# EAGLE design plug-v19-Make-board-myself-to-test-circuit (EAGLE 7.6.0)
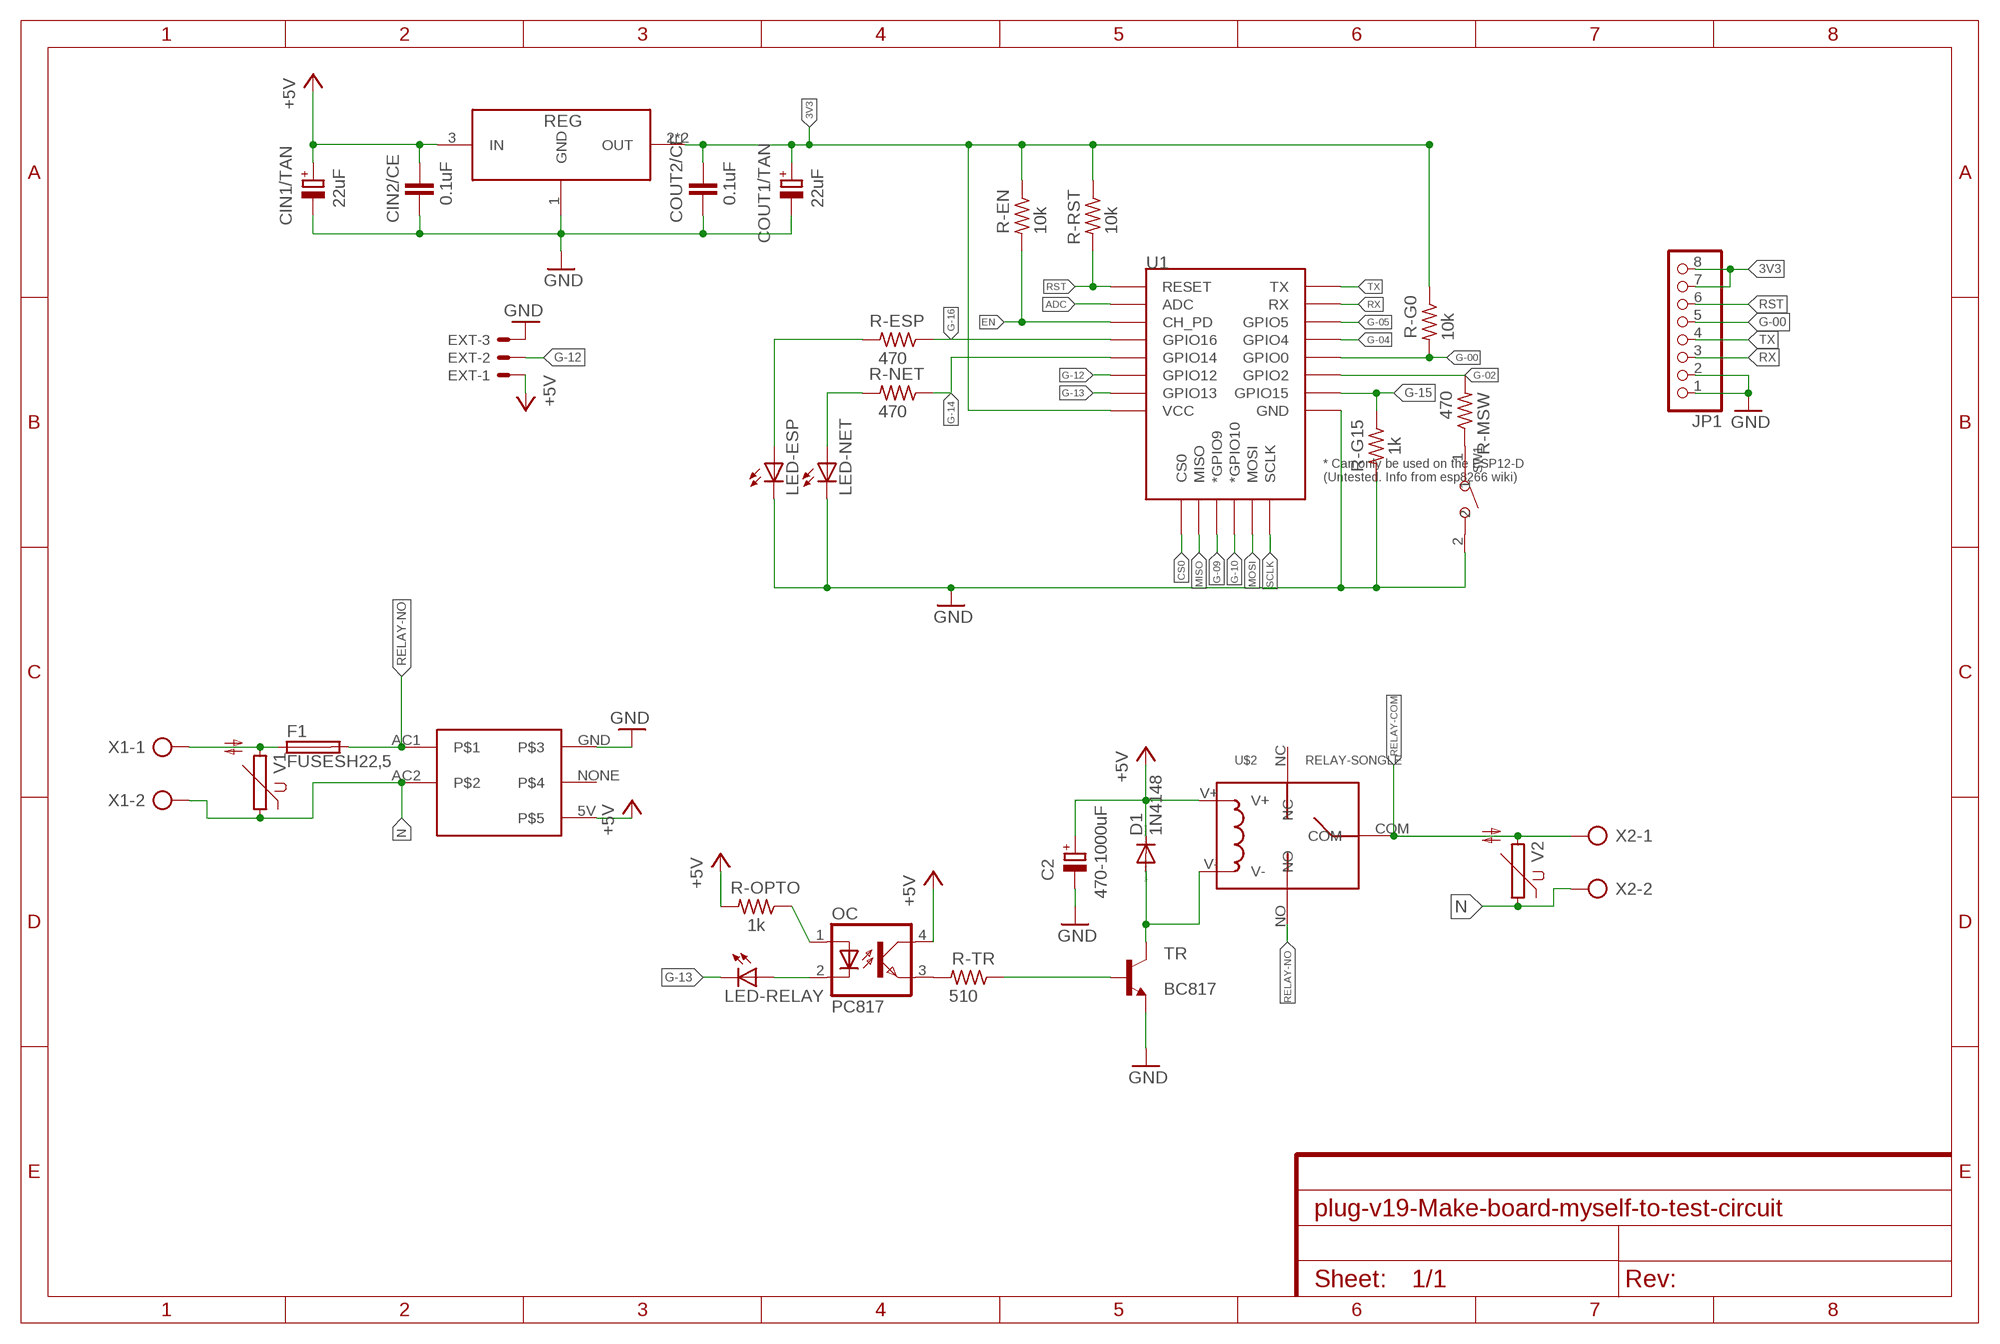
[diagram p0: schematic, sheet 1]

## Parts
C2  470-1000uF  CPOL-EUE3.5-8  [E3,5-8]
CIN1/TAN  22uF  CPOL-EUB/3528-21R  [B/3528-21R]
CIN2/CE  0.1uF  C-EUC0805K  [C0805K]
COUT1/TAN  22uF  CPOL-EUB/3528-21R  [B/3528-21R]
COUT2/CE  0.1uF  C-EUC0805K  [C0805K]
D1  1N4148  1N4148DO35-7  [DO35-7]
EXT  53048-03  [53048-03]
F1  FUSESH22,5  [SH22,5]
JP1  PINHD-1X8  [1X08]
LED-ESP  LEDCHIPLED_0805  [CHIPLED_0805]
LED-NET  LEDCHIPLED_0805  [CHIPLED_0805]
LED-RELAY  LEDCHIPLED_0805  [CHIPLED_0805]
OC  PC817  [DIL04]
R-EN  10k  R-US_M0805  [M0805]
R-ESP  470  R-US_M0805  [M0805]
R-G0  10k  R-US_M0805  [M0805]
R-G15  1k  R-US_M0805  [M0805]
R-MSW  470  R-US_M0805  [M0805]
R-NET  470  R-US_M0805  [M0805]
R-OPTO  1k  R-US_M0805  [M0805]
R-RST  10k  R-US_M0805  [M0805]
R-TR  510  R-US_M0805  [M0805]
REG  AMS1117-3.3  [SOT-223]
SW1  DIP-BUTTON(2P-6.0X3.0X4.3MM)-TS-1101F  [SW2-5.0-6.0X3.0X4.3MM]
TR  BC817  BC817-16SMD  [SOT23-BEC]
U1  ESP12ESMD  [ESP12E-SMD]
U$2  RELAY-SONGLE  [RELAY-SONGLE]
U$4  POWERSUPPLY-5V-700MA  [POWERSUPPLY-5V-700MA]
V1  S14K11  [S14K11]
V2  S14K11  [S14K11]
X1  AK300/2  [AK300/2]
X2  AK300/2  [AK300/2]

## Nets
3V3: COUT1/TAN.+ COUT2/CE.1 JP1.7 JP1.8 R-EN.1 R-G0.1 R-RST.1 REG.2(OUT) REG.4(OUT) U1.VCC
+5V: C2.+ CIN1/TAN.+ CIN2/CE.1 D1.C EXT.1 OC.4(COL) R-OPTO.2 REG.3(IN) U$2.V+ U$4.5V
ADC: U1.ADC
CS0: U1.CS0
EN: R-EN.2 U1.CH_PD
G-00: JP1.5 R-G0.2 U1.GPIO0
G-02: R-MSW.2 U1.GPIO2
G-04: U1.GPIO4
G-05: U1.GPIO5
G-09: U1.GPIO9(*GPIO9)
G-10: U1.GPIO10(*GPIO10)
G-12: EXT.2 U1.GPIO12
G-13: LED-RELAY.C U1.GPIO13
G-14: R-NET.1 U1.GPIO14
G-15: R-G15.1 U1.GPIO15
G-16: R-ESP.1 U1.GPIO16
GND: C2.- CIN1/TAN.- CIN2/CE.2 COUT1/TAN.- COUT2/CE.2 EXT.3 JP1.1 JP1.2 LED-ESP.C LED-NET.C R-G15.2 REG.1(GND) SW1.2 TR.E U1.GND U$4.GND
LINE: F1.1 V1.2 X1.1
MISO: U1.MISO
MOSI: U1.MOSI
N: U$4.AC2 V1.1 V2.1 X1.2 X2.2
N$1: OC.3(EMIT) R-TR.2
N$2: R-TR.1 TR.B
N$6: LED-ESP.A R-ESP.2
N$13: OC.1(A) R-OPTO.1
N$16: LED-NET.A R-NET.2
N$17: D1.A TR.C U$2.V-
N$21: LED-RELAY.A OC.2(C)
N$22: R-MSW.1 SW1.1
RELAY-COM: U$2.COM V2.2 X2.1
RELAY-NO: F1.2 U$2.NO U$4.AC1
RST: JP1.6 R-RST.2 U1.RESET
RX: JP1.3 U1.RXD0(RX)
SCLK: U1.SCLK
TX: JP1.4 U1.TXD0(TX)
Unconnected: U$2.NC U$4.NONE

## Library data of the parts
C2 CIN1/TAN COUT1/TAN = rcl:CPOL-EU: POLARIZED CAPACITOR, European symbol
CIN2/CE COUT2/CE = rcl:C-EU: CAPACITOR, European symbol
D1 = diode:1N4148: DIODE high speed (Philips)
EXT = con-molex:53?-03: CONNECTOR wire to board 1.25 mm (.049 inch) pitch header; MF: WALDOM/MOLEX; MPN: 53048-0310; OC_FARNELL: 9732918; OC_NEWARK: 38C9908
F1 = fuse:FUSE: Fuse; OC_FARNELL: unknown; OC_NEWARK: unknown
JP1 = pinhead:PINHD-1X8: PIN HEADER
LED-ESP LED-NET LED-RELAY = led:LED: LED OSRAM: - CHIPLED LG R971, LG N971, LY N971, LG Q971, LY Q971, LO R971, LY R971 LH N974, LH R974 LS Q976, LO Q976, LY Q976 LO Q996 - Hyper CHIPLED LW Q18S LB Q993, LB Q99A, LB R99A - SideLED LS A670, LO A670, LY A670, LG A670, LP A670 LB A673, LV A673, LT A673, LW A673 LH A674 LY A675 LS A676, LA A676, LO A676, LY A676, LW A676 LS A679, LY A679, LG A679 - Hyper Micro SIDELED® LS Y876, LA Y876, LO Y876, LY Y876 LT Y87S - SmartLED LW L88C, LW L88S LB L89C, LB L89S, LG L890 LS L89K, LO L89K, LY L89K LS L896, LA L896, LO L896, LY L896 - TOPLED LS T670, LO T670, LY T670, LG T670, LP T670 LSG T670, LSP T670, LSY T670, LOP T670, LYG T670 LG T671, LOG T671, LSG T671 LB T673, LV T673, LT T673, LW T673 LH T674 LS T676, LA T676, LO T676, LY T676, LB T676, LH T676, LSB T676, LW T676 LB T67C, LV T67C, LT T67C, LS T67K, LO T67K, LY T67K, LW E67C LS E67B, LA E67B, LO E67B, LY E67B, LB E67C, LV E67C, LT E67C LW T67C LS T679, LY T679, LG T679 LS T770, LO T770, LY T770, LG T770, LP T770 LB T773, LV T773, LT T773, LW T773 LH T774 LS E675, LA E675, LY E675, LS T675 LS T776, LA T776, LO T776, LY T776, LB T776 LHGB T686 LT T68C, LB T68C - Hyper Mini TOPLED® LB M676 - Mini TOPLED Santana® LG M470 LS M47K, LO M47K, LY M47K Source: http://www.osram.convergy.de LUXEON: - LUMILED® LXK2-PW12-R00, LXK2-PW12-S00, LXK2-PW14-U00, LXK2-PW14-V00 LXK2-PM12-R00, LXK2-PM12-S00, LXK2-PM14-U00 LXK2-PE12-Q00, LXK2-PE12-R00, LXK2-PE12-S00, LXK2-PE14-T00, LXK2-PE14-U00 LXK2-PB12-K00, LXK2-PB12-L00, LXK2-PB12-M00, LXK2-PB14-N00, LXK2-PB14-P00, LXK2-PB14-Q00 LXK2-PR12-L00, LXK2-PR12-M00, LXK2-PR14-Q00, LXK2-PR14-R00 LXK2-PD12-Q00, LXK2-PD12-R00, LXK2-PD12-S00 LXK2-PH12-R00, LXK2-PH12-S00 LXK2-PL12-P00, LXK2-PL12-Q00, LXK2-PL12-R00 Source: www.luxeon.com KINGBRIGHT: KA-3528ASYC Source: www.kingbright.com
OC = optocoupler:PC817: SHARP OPTO COUPLER; MPN: PC817X4J000F; OC_FARNELL: 9707727; OC_NEWARK: 97K7059
R-EN R-ESP R-G0 R-G15 R-MSW R-NET R-OPTO R-RST R-TR = rcl:R-US_: RESISTOR, American symbol
REG = AMS1117-3.3:AMS1117-3.3: 1A LOW DROPOUT VOLTAGE REGULATOR
SW1 = Seeed-OPL-Switch:DIP-BUTTON(2P-6.0X3.0X4.3MM): 311020025
TR = transistor-npn:BC817*: NPN Transistor
U1 = esp8266modules:ESP12E: ESP12E Module
U$2 = Relay-Songle:RELAY-SONGLE
U$4 = PowerSupply-5V-700mA:POWERSUPPLY-5V-700MA
V1 V2 = varistor:S14K11: VARISTOR
X1 X2 = con-ptr500:AK300/2: CONNECTOR; OC_FARNELL: unknown; OC_NEWARK: unknown

## Board
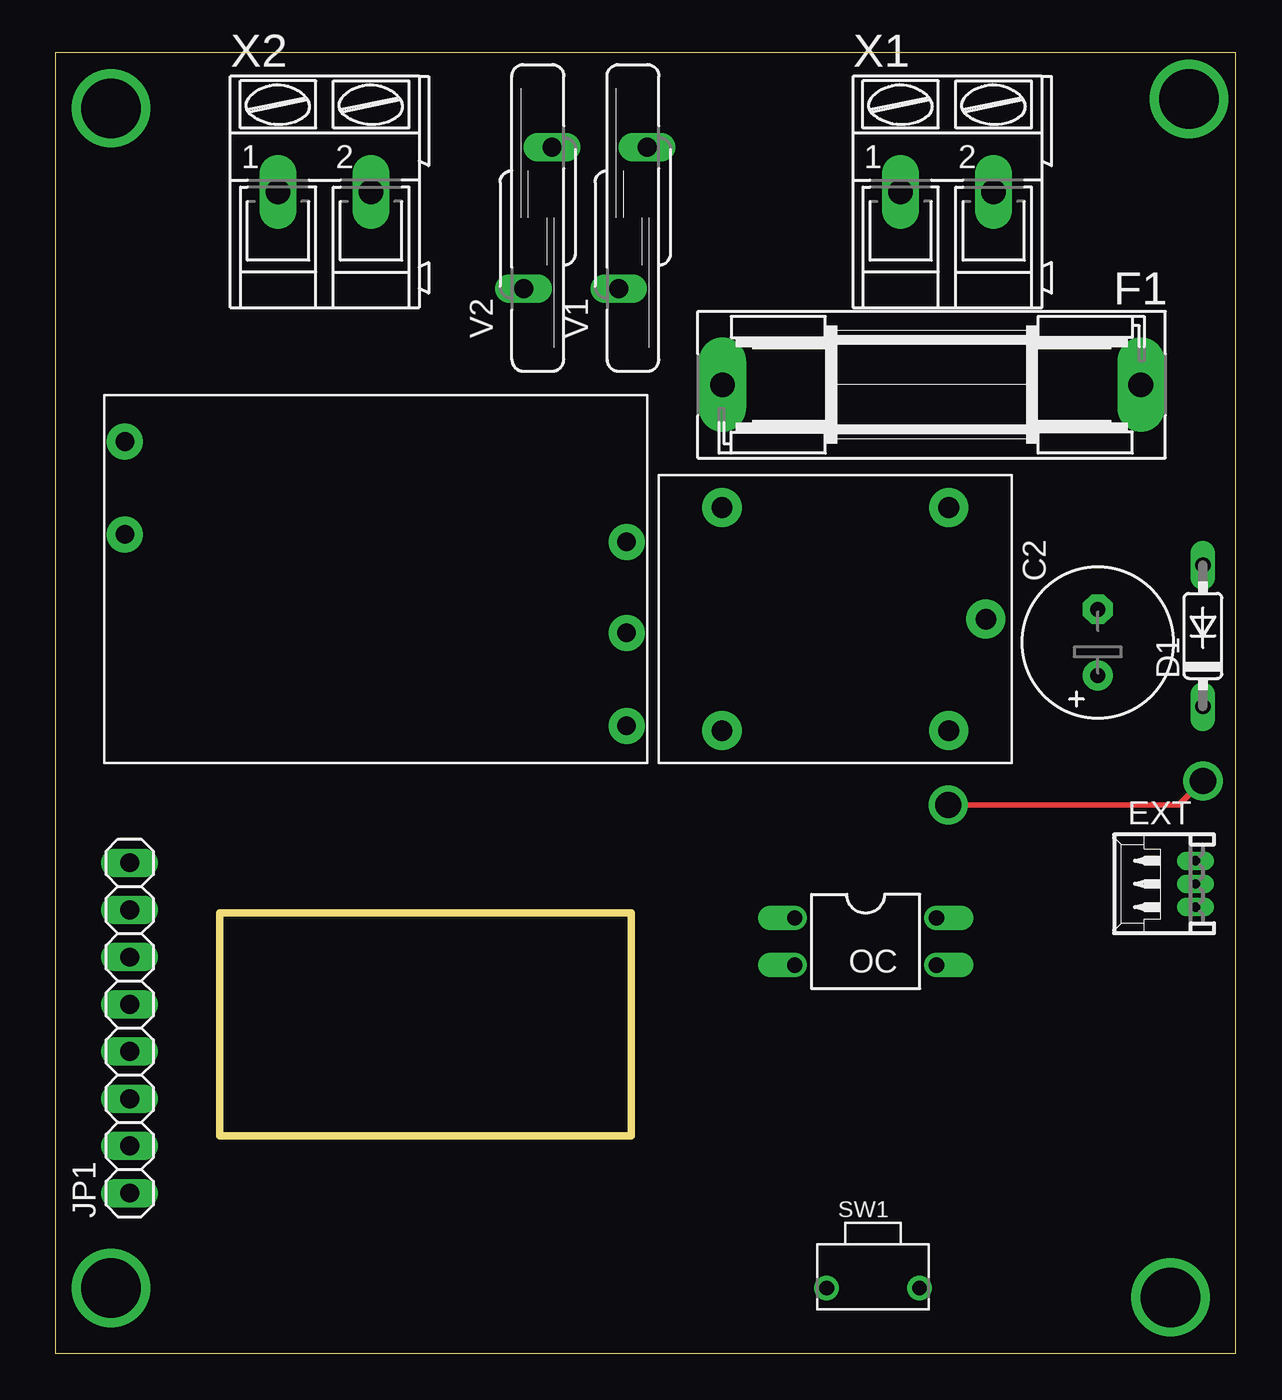
[diagram p1: board, top side]
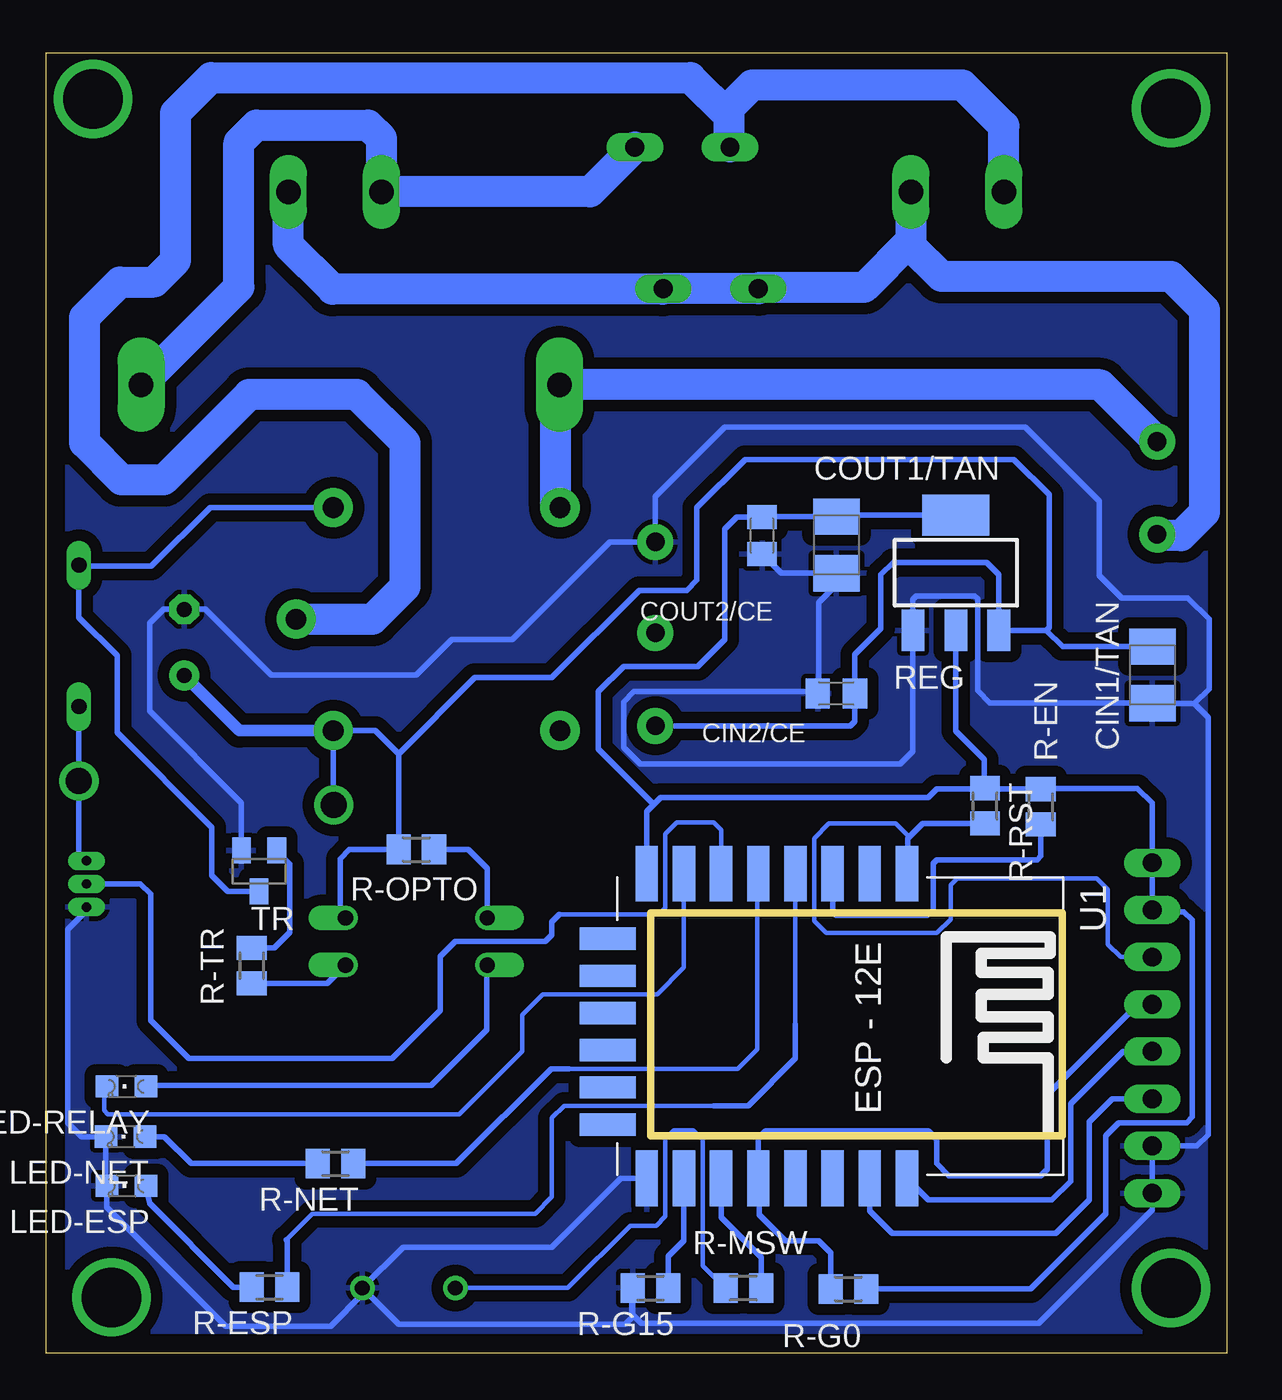
[diagram p2: board, bottom side, seen from below]

Size 63.5 x 69.98 mm. Coordinates in mm from the lower left corner, seen from the top.
Outline: 8.85,11.7 31,11.7 31,23.7 8.85,23.7 8.85,11.75
Outline: 0,0 63.5,0 63.5,69.98 0,69.98 0,0
Copper layers (1*16): Top 0.035mm / dielectric 1.5mm / Bottom 0.035mm
Design rules "default": minimum track width 10mil, minimum drill 24mil, track to track 8mil, track to pad 8mil, pad to pad 8mil, via to via 8mil, smd to smd 8mil, copper to edge 40mil, drill to drill 8mil, minimum pad ring 10mil, minimum via ring 8mil, stop-mask expansion 4mil, vias tented up to drill 0mil, thermal gap 10mil

### Footprints (pad centres in the part's own frame; a part is rotated, then mirrored left to right if it is on the bottom)
E3,5-8 = drill 0.813 pad 1.6: + -1.778,0 | drill 0.813 pad 1.6 octagon: - 1.778,0
B/3528-21R = smd 1.95 x 2.5: + 1.525,0; - -1.525,0
C0805K = smd 1.3 x 1.6: 1 -1,0; 2 1,0
DO35-7 = drill 0.813 long: A 3.81,0; C -3.81,0
53048-03 = drill 0.5 pad 0.698 long: 1 1.25,-1.25; 2 0,-1.25; 3 -1.25,-1.25
SH22,5 = drill 1.321 pad 2.54 long: 1 -11.252,0; 2 11.252,0
1X08 = drill 1.016 long: 1 -8.89,0; 2 -6.35,0; 3 -3.81,0; 4 -1.27,0; 5 1.27,0; 6 3.81,0; 7 6.35,0; 8 8.89,0
CHIPLED_0805 = smd 1.2 x 1.2: A 0,-1.05; C 0,1.05
DIL04 = drill 0.813 offset: 1 -1.27,-3.81; 2 1.27,-3.81; 3 1.27,3.81; 4 -1.27,3.81
M0805 = smd 1.3 x 1.6: 1 -0.95,0; 2 0.95,0
SOT-223 = smd 1.219 x 2.235: 1 -2.381,-3.099; 2 -0.07,-3.099; 3 2.241,-3.099 | smd 3.6 x 2.2: 4 -0.07,3.099
SW2-5.0-6.0X3.0X4.3MM = drill 0.8 pad 1.27: 1 -2.5,0; 2 2.5,0
SOT23-BEC = smd 1 x 1.4: B -0.95,-1.1; C 0,1.1; E 0.95,-1.1
ESP12E-SMD = smd 3 x 1.2: ADC -8.3,3.8; CH_PD -8.3,1.8; GND 8.1,-8.2; GPIO0 8.1,-2.2; GPIO2 8.1,-4.2; GPIO4 8.1,-0.2; GPIO5 8.1,1.8; GPIO12 -8.3,-4.2; GPIO13 -8.3,-6.2; GPIO14 -8.3,-2.2; GPIO15 8.1,-6.2; GPIO16 -8.3,-0.2; RESET -8.3,5.8; RXD0 8.1,3.8; TXD0 8.1,5.8; VCC -8.3,-8.2 | smd 1.2 x 3: CS0 -4.8,-10.3; GPIO9 -0.8,-10.3; GPIO10 1.2,-10.3; MISO -2.8,-10.3; MOSI 3.2,-10.3; SCLK 5.2,-10.3
RELAY-SONGLE = drill 1.118 pad 2.1: COM -8.1,0; NC 6.1,6; NO 6.1,-6; V+ -6.1,6; V- -6.1,-6
POWERSUPPLY-5V-700MA = drill 1 pad 1.93: 5V 13.5,-7.9; AC1 -13.5,7.4; AC2 -13.5,2.4; GND 13.5,2; NONE 13.5,-2.9
S14K11 = drill 1.016 long: 1 -0.762,-3.81; 2 0.762,3.81
AK300/2 = drill 1.321 long: 1 -2.515,0; 2 2.489,0

### Placement (x,y rotation side)
C2  56.09,38.25 90 top
CIN1/TAN  4,36.5 90 bottom
CIN2/CE  21,35.5 180 bottom
COUT1/TAN  21,43.5 90 bottom
COUT2/CE  25,44 270 bottom
D1  61.75,38.6 90 top
EXT  60.1,25.25 90 top
F1  47.15,52.12 180 top
JP1  4,17.5 90 top
LED-ESP  59.2,9 90 bottom
LED-NET  59.25,11.65 90 bottom
LED-RELAY  59.2,14.35 90 bottom
OC  43.6,22.15 270 top
R-EN  10,29.4 270 bottom
R-ESP  51.5,3.55 180 bottom
R-G0  20.35,3.45 180 bottom
R-G15  31,3.5 180 bottom
R-MSW  26,3.5 0 bottom
R-NET  47.95,10.2 180 bottom
R-OPTO  43.6,27.1 180 bottom
R-RST  13,29.45 270 bottom
R-TR  52.45,20.85 270 bottom
REG  14.5,42 0 bottom
SW1  44,3.5 0 top
TR  52.06,25.94 180 bottom
U1  23,17.5 270 bottom
U$2  41.97,39.5 180 top
U$4  17.24,41.66 0 top
V1  31.08,61.1 0 top
V2  25.96,61.1 0 top
X1  48,62.5 0 top
X2  14.5,62.5 0 top

### Tracks (layer width: path | path; a pad name or v marks a point on that pad's centre or on a via)
3V3
  Bottom 0.254: 4,23.75 JP1.7
  Bottom 0.305: 4,23.75 2.3,23.75 1.85,23.3 1.85,12.7 2.15,12.4 5.8,12.4 6.5,11.7 6.5,7.5 10.55,3.45 R-G0.1 | JP1.7 JP1.8 4,29.6 4.8,30.4 9.95,30.4 R-EN.1 12.95,30.35 R-RST.1 | REG.2 14.57,33.47 13.05,31.95 13.05,30.45 R-RST.1 | U1.VCC 31.2,29.15 30.82,29.52 | 30.82,29.52 30.45,29.9 16.05,29.9 15.6,30.35 13.05,30.35 R-RST.1 | REG.4 20.93,45.1 COUT1/TAN.+ 24.98,45.02 COUT2/CE.1 26.35,45 27,44.35 27,38.4 28.45,36.95 32.45,36.95 33.8,35.6 33.8,32.5 30.82,29.52
+5V  (via drill 1.4)
  Top 0.305: v61.75,30.8 60.45,29.5 v48.05,29.5
  Bottom 0.305: 9.7,38.9 REG.3 12.25,41.9 12.9,42.55 17.95,42.55 18.6,41.9 18.6,39 20,37.6 CIN2/CE.1 20,34 20.24,33.76 U$4.5V | 9.7,38.9 9.55,39.05 9.55,46.2 11.45,48.1 25.9,48.1 28.5,45.5 28.5,41.6 29.05,41.05 31.6,41.05 36.3,36.35 40.45,36.35 44.55,32.25 | 44.55,32.25 R-OPTO.2 47.2,27.1 47.7,26.6 47.7,23.71 OC.4 | 9.7,38.9 8.82,38.02 CIN1/TAN.+ | 44.55,32.25 45.8,33.5 U$2.V+ 48.07,29.52 v48.05,29.5 | D1.C v61.75,30.8 61.75,26.9 EXT.1
  Bottom 0.61: U$2.V+ 53.12,33.5 C2.+
EN
  Bottom 0.305: U1.CH_PD 21.2,23.75 21,23.55 16.1,23.55 15.8,23.85 15.8,26.35 15.6,26.55 10.2,26.55 10,26.75 R-EN.2
G-00
  Bottom 0.305: JP1.5 4.78,18.77 9.65,13.9 9.65,9.9 10,9.55 14.95,9.55 15.6,10.2 15.6,11.5 16.05,11.95 24.8,11.95 25.2,11.55 U1.GPIO0 25.15,9.35 25.15,7.45 23.75,6.05 21.95,6.05 21.3,5.4 R-G0.2
G-02
  Bottom 0.305: U1.GPIO2 27.2,7.3 25.05,5.15 R-MSW.2
G-12
  Bottom 0.254: 35.9,23.6 30.55,23.6 30.2,23.95 30.2,27.95 29.6,28.55 27.6,28.55 27.2,28.15 U1.GPIO12
  Bottom 0.305: 35.9,23.6 36.3,23.2 36.3,22.5 36.65,22.15 41.5,22.15 42.3,21.35 42.3,18.45 44.9,15.85 55.85,15.85 57.9,17.9 57.9,24.7 58.45,25.25 EXT.2
G-13
  Bottom 0.254: LED-RELAY.C 60.4,14.2 60.4,13.05 60.2,12.85 41.3,12.85 37.9,16.25 37.9,18.2 36.8,19.3 30.65,19.3 29.2,20.75 U1.GPIO13
G-14
  Bottom 0.254: U1.GPIO14 25.25,25.75 25.25,16.35 26.3,15.3 35.4,15.3
  Bottom 0.305: R-NET.1 41.45,10.2 36.35,15.3 35.4,15.3
G-15
  Bottom 0.305: U1.GPIO15 29.2,6.05 30.05,5.2 R-G15.1
G-16
  Bottom 0.254: U1.GPIO16 23.2,17.7 | 27.6,13.3 35.65,13.3 36.3,12.65 36.3,8.4 37.2,7.5 49.2,7.5 50.6,6.1
  Bottom 0.305: 50.6,6.1 50.55,6.05 R-ESP.1 | 23.2,17.7 23.2,15.85 25.75,13.3 27.6,13.3
GND
  Bottom 0.254: 32,3.5 R-G15.2 | 16.75,39 REG.1 | 4,35 CIN1/TAN.-
  Bottom 0.305: 32,3.45 R-G15.2 31.95,2.05 31.5,1.6 10.1,1.6 4,7.7 JP1.1 JP1.2 1.6,11.15 1,11.75 1,34.2 1.75,34.95 | U1.GND 32.6,9.4 36.3,5.7 44.3,5.7 SW1.2 | 3.88,35.1 CIN1/TAN.- 3.98,34.95 1.75,34.95 | 4,35 12.75,35 13.4,35.65 13.4,40.6 13.55,40.75 16.7,40.75 16.9,40.55 16.9,38.92 REG.1 16.88,32.37 17.55,31.7 31.55,31.7 32.45,32.6 32.45,35.05 31.9,35.6 22.1,35.6 CIN2/CE.2 21.95,35.55 21.95,40.4 21,41.35 COUT1/TAN.- 23.98,41.98 COUT2/CE.2 | 56.06,40 C2.- | C2.- 56.11,40.05 57.2,40.05 57.95,39.3 57.95,34.55 53.01,29.61 TR.E | EXT.3 61.35,23.8 62.35,22.8 62.35,12.4 61.6,11.65 LED-NET.C 60.3,9.05 LED-ESP.C 60.25,7.85 53.85,1.45 48.2,1.45 46.5,3.15 SW1.2 | C2.- 56.07,40.05 54.95,40.05 51.4,36.5 43.6,36.5 41.7,38.4 38.45,38.4 33.19,43.66 U$4.GND 30.75,46.1 27,49.85 10.85,49.85 6.85,45.85 6.85,41.85 5.65,40.65 2.1,40.65 0.95,39.5 0.95,35.75 1.75,34.95 | 32,3.5 32,1.9 32.35,1.55 44.55,1.55 SW1.2
  pour Bottom (isolate 0.61): 0,0 63.5,0 63.5,70 0,70
LINE
  Bottom 1.676: F1.1 53.15,57.37 53.15,65.15 52.2,66.1 46.2,66.1 45.48,65.39 X1.1 34.25,62.5 V1.2
N
  Bottom 1.676: U$4.AC2 3.68,44 2.45,44 1.2,45.25 1.2,56.15 3,57.95 15.35,57.95 16.99,59.59 X2.2 16.99,59.86 19.5,57.35 25.14,57.35 V2.1 V1.1 30.36,57.25 48.1,57.25 50.49,59.64 X1.2
N$1
  Bottom 0.305: OC.3 48.39,19.9 R-TR.2
N$2
  Bottom 0.305: 51.11,26.76 TR.B 50.4,26.33 50.4,22.65 51.25,21.8 R-TR.1
N$3  (via drill 3.2)
  other vias: 3,67
N$4  (via drill 3.2)
  other vias: 3,3.5
N$5  (via drill 3.2)
  other vias: 60,3
N$6
  Bottom 0.305: R-ESP.2 53.45,3.55 57.95,8.05 LED-ESP.A
N$7  (via drill 3.2)
  other vias: 61,67.5
N$13
  Bottom 0.305: R-OPTO.1 40.8,27.1 39.79,26.09 OC.1
N$16
  Bottom 0.305: R-NET.2 55.7,10.2 57.15,11.65 LED-NET.A
N$17
  Bottom 0.305: U$2.V- 54.7,45.5 57.85,42.35 61.69,42.35 D1.A 61.75,39.6 59.7,37.55 59.7,33.4 54.6,28.3 54.6,25.7 53.74,24.84 TR.C
N$21
  Bottom 0.305: LED-RELAY.A 58.1,14.4 42.8,14.4 39.8,17.4 OC.2
N$22
  Bottom 0.254: SW1.1 35.45,3.5 32.1,6.85 30.7,6.85 30.2,7.35 30.2,11.55 29.75,12 28.7,12 28.2,11.5 28.2,4.7 27,3.5 R-MSW.1
RELAY-COM
  Bottom 1.676: X2.1 11.98,66.03 14.2,68.25 25.55,68.25 26.8,67 26.8,66.6 | 26.8,66.6 26.8,64.99 V2.2 | 26.8,66.6 28.85,68.65 54.65,68.65 56.55,66.75 56.55,58.8 57.7,57.65 59.55,57.65 61.45,55.75 61.45,49 59.45,47 57.2,47 52.6,51.6 46.8,51.6 44.2,49 44.2,41.25 45.95,39.5 U$2.COM
RELAY-NO
  Bottom 1.676: U$4.AC1 6.8,52.12 F1.2 36.12,51.9 36.12,45.75 U$2.NO
RST
  Bottom 0.254: JP1.6 5.71,21.31 6.4,22 6.4,24.95 7,25.55 14.5,25.55 14.85,25.2 14.85,23.35 15.6,22.6 21.55,22.6 22.2,23.25 22.2,27.7 21.4,28.5 17.8,28.5 17.15,27.85 17.15,27.7
  Bottom 0.305: R-RST.2 16.35,28.5 17.15,27.7 17.15,25.85 U1.RESET
RX
  Bottom 0.305: JP1.3 6.16,13.69 7.4,12.45 7.4,8.25 9.2,6.45 18,6.45 19.2,7.65 U1.RXD0
TX
  Bottom 0.305: JP1.4 5.57,16.23 8.4,13.4 8.4,9.25 9.4,8.25 16.05,8.25 U1.TXD0